# EAGLE design TCA0372_3x (EAGLE 9.3.0)
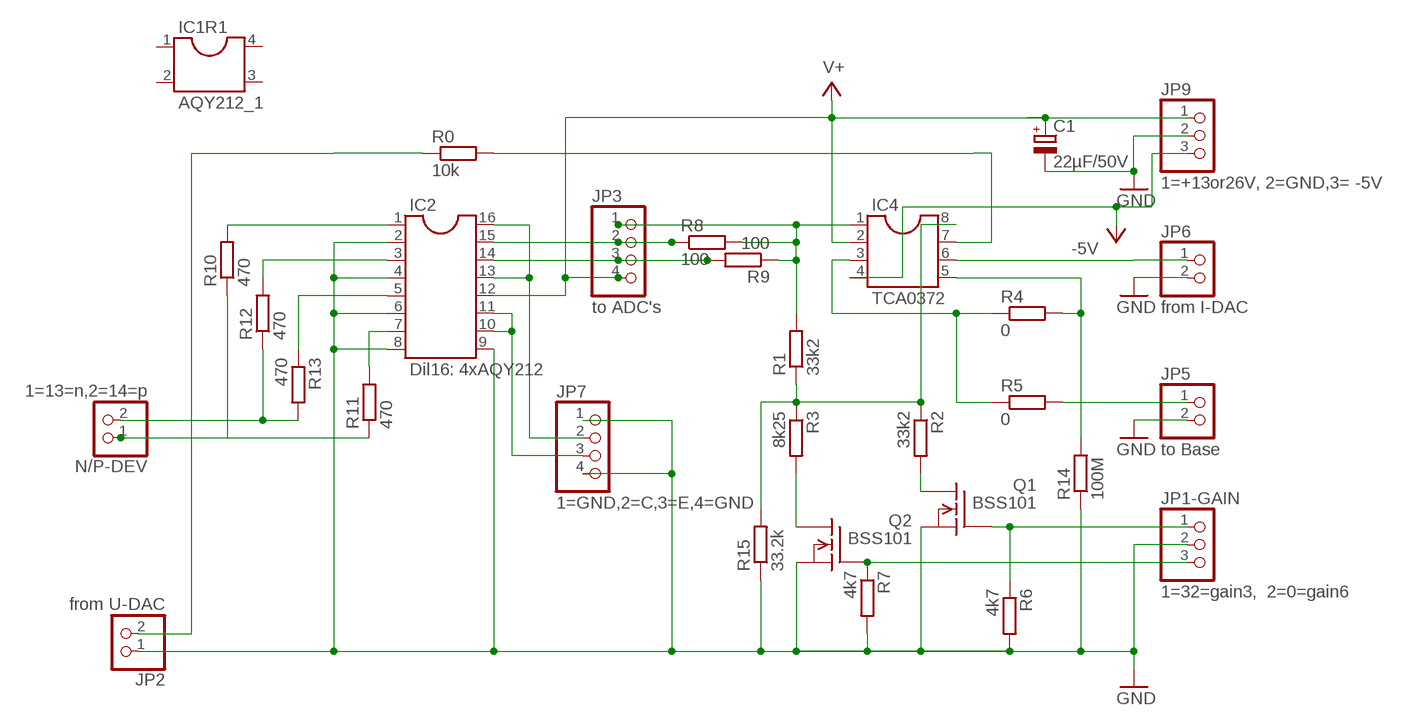
[diagram p0: schematic, sheet 1]

## Parts
C1  22µF/50V  CPOL-EUE5-10.5  [E5-10,5]
IC1R1  AQY212_1  DIL4S  [SOCKET-04]
IC2  Dil16: 4xAQY212  DIL16S  [SOCKET-16]
IC4  TCA0372  DIL8S  [SOCKET-08]
JP1-GAIN  1=32=gain3, 2=0=gain6  PINHD-1X3  [1X03]
JP2  from U-DAC  PINHD-1X2  [1X02]
JP3  to ADC's  PINHD-1X4  [1X04]
JP5  to Base  PINHD-1X2  [1X02]
JP6  from I-DAC  PINHD-1X2  [1X02]
JP7  1=GND,2=C,3=E,4=GND  PINHD-1X4  [1X04]
JP9  1=+13or26V, 2=GND,3= -5V  PINHD-1X3  [1X03]
N/P-DEV  1=13=n,2=14=p  PINHD-1X2  [1X02]
Q1  BSS101  [TO92]
Q2  BSS101  [TO92]
R0  10k  R-EU_0207/7  [0207/7]
R1  33k2  R-EU_0207/7  [0207/7]
R2  33k2  R-EU_0207/7  [0207/7]
R3  8k25  R-EU_0207/7  [0207/7]
R4  0  R-EU_0207/7  [0207/7]
R5  0  R-EU_0207/7  [0207/7]
R6  4k7  R-EU_0207/7  [0207/7]
R7  4k7  R-EU_0207/7  [0207/7]
R8  100  R-EU_0207/7  [0207/7]
R9  100  R-EU_0207/7  [0207/7]
R10  470  R-EU_0207/7  [0207/7]
R11  470  R-EU_0207/7  [0207/7]
R12  470  R-EU_0207/7  [0207/7]
R13  470  R-EU_0207/7  [0207/7]
R14  100M  R-EU_0207/7  [0207/7]
R15  33.2k  R-EU_0207/7  [0207/7]

## Nets
-5V: IC4.4 JP9.3
GND: C1.- IC2.2 IC2.4 IC2.6 IC2.8 IC2.9 JP1-GAIN.2 JP2.1 JP5.2 JP6.2 JP7.1 JP7.4 JP9.2 Q1.1(S) Q2.1(S) R6.2 R7.2 R14.1 R15.1
N$1: IC4.5 R4.2 R14.2
N$2: IC2.15 JP3.2 R8.1
N$3: IC4.7 R0.2
N$4: IC2.7 R11.2
N$5: Q1.3(D) R2.2
N$6: Q2.3(D) R3.2
N$7: JP1-GAIN.1 Q1.2(G) R6.1
N$8: JP1-GAIN.3 Q2.2(G) R7.1
N$9: IC4.6 JP6.1
N$10: IC2.3 R12.2
N$11: IC2.13 IC2.16 JP7.2
N$12: JP2.2 R0.1
N$13: IC4.3 R4.1 R5.1
N$15: IC2.5 R13.1
N$16: N/P-DEV.2 R12.1 R13.2
N$17: IC2.1 R10.2
N$19: N/P-DEV.1 R10.1 R11.1
N$20: JP5.1 R5.2
N$21: IC4.1 JP3.1 R1.2 R8.2 R9.1
N$22: IC4.8 R1.1 R2.1 R3.1 R15.2
N$23: IC2.10 IC2.11 JP7.3
N$25: IC2.14 JP3.3 R9.2
V+: C1.+ IC2.12 IC4.2 JP3.4 JP9.1
Unconnected: IC1R1.1 IC1R1.2 IC1R1.3 IC1R1.4

## Library data of the parts
C1 = rcl:CPOL-EU: POLARIZED CAPACITOR, European symbol; SPICEPREFIX: C
IC1R1 = ic-package:DIL4: Dual In Line / Socket
IC2 = ic-package:DIL16: Dual In Line / Socket
IC4 = ic-package:DIL8: Dual In Line / Socket
JP1-GAIN JP9 = pinhead:PINHD-1X3: PIN HEADER
JP2 JP5 JP6 N/P-DEV = pinhead:PINHD-1X2: PIN HEADER
JP3 JP7 = pinhead:PINHD-1X4: PIN HEADER
Q1 Q2 = transistor-fet:BSS101: N-Channel Enhancement MOSFET 200V; 0,16A; 11Ohm
R0 R1-R15 = rcl:R-EU_: RESISTOR, European symbol; SPICEPREFIX: R

## Board
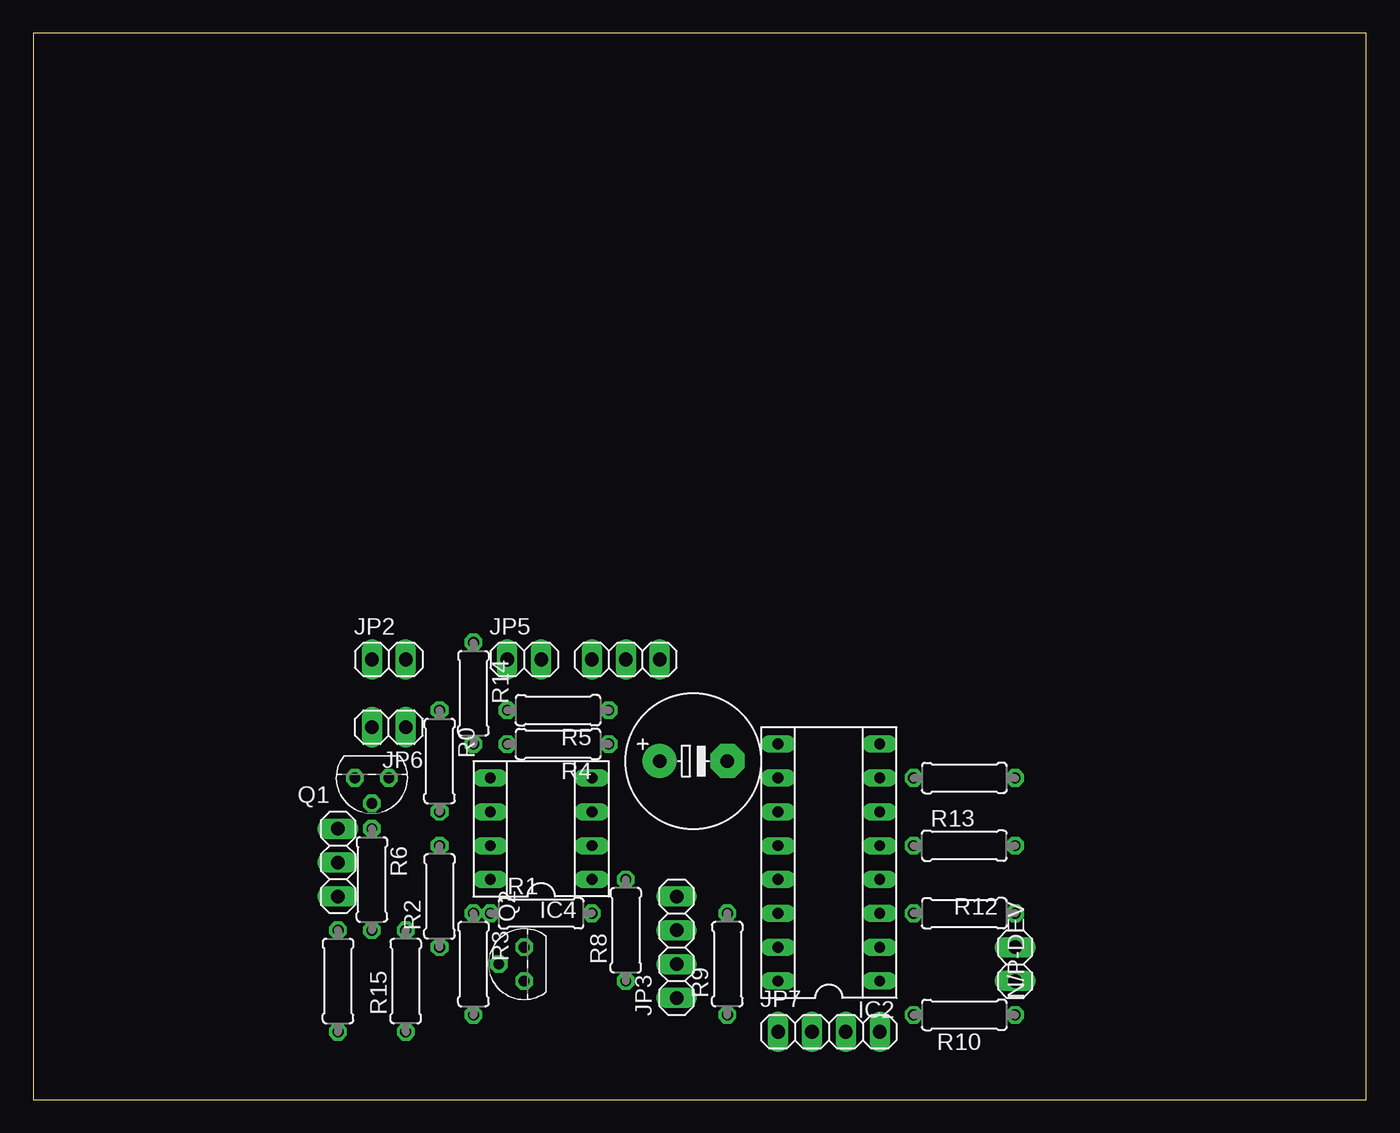
[diagram p1: board, top side]
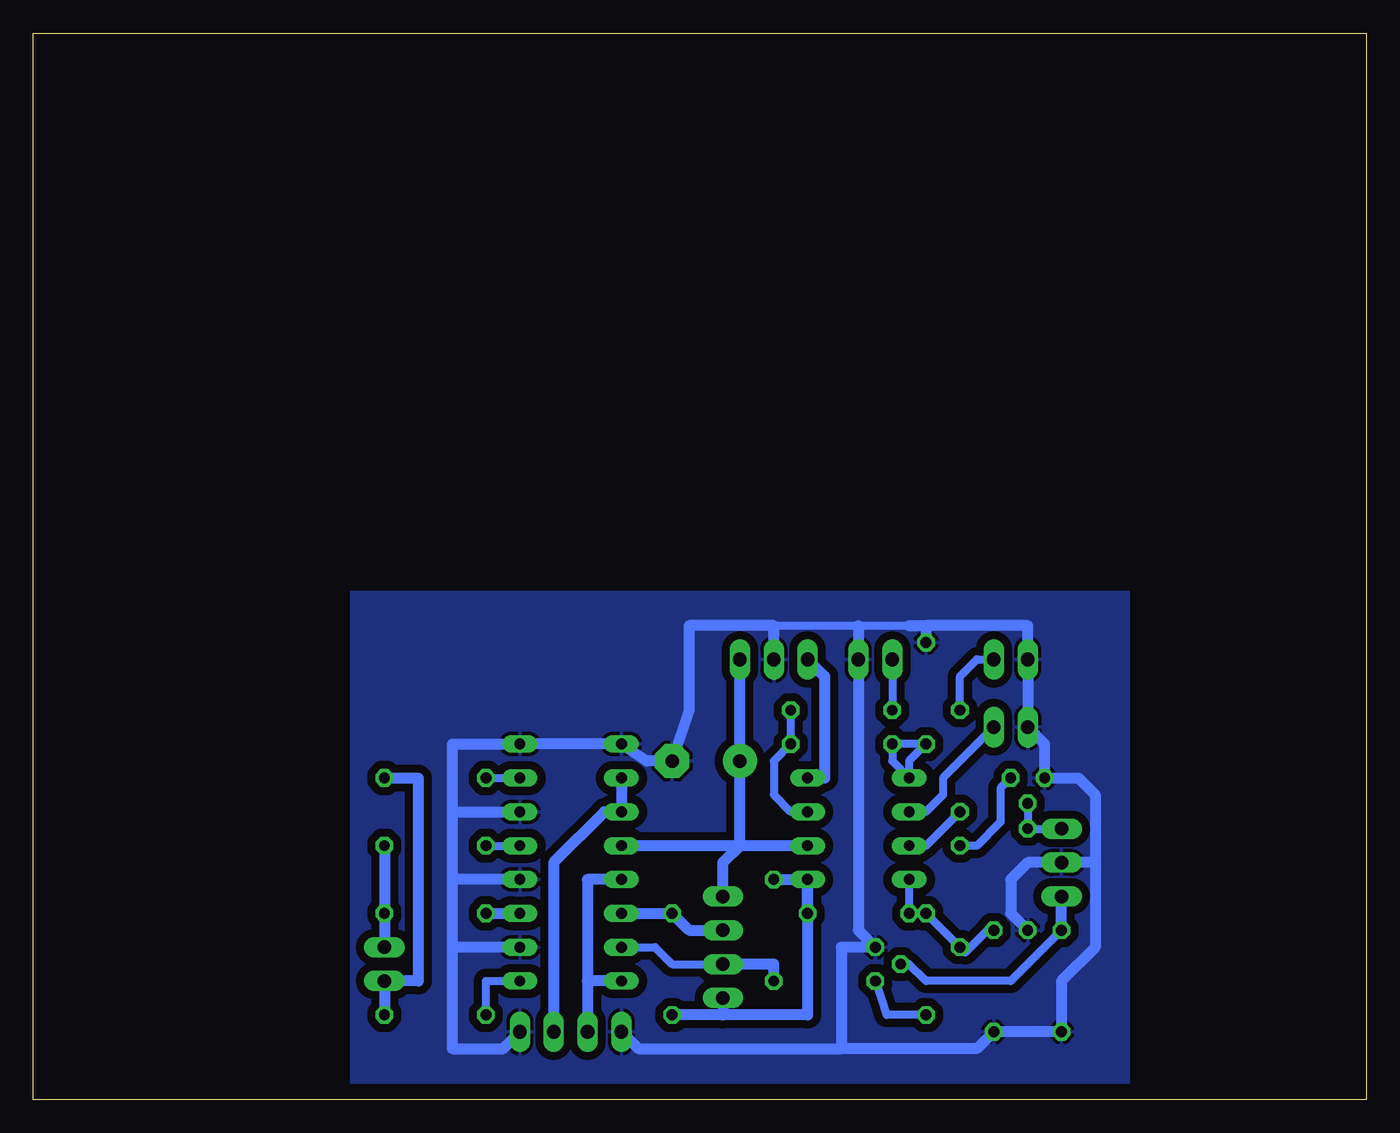
[diagram p2: board, bottom side, seen from below]

Size 100 x 80 mm. Coordinates in mm from the lower left corner, seen from the top.
Outline: 0,0 100,0 100,80 0,80 0,0
Copper layers (1*16): Top 0.035mm / dielectric 1.5mm / Bottom 0.035mm
Design rules "default": minimum track width 6mil, minimum drill 0.35mm, track to track 6mil, track to pad 6mil, pad to pad 6mil, via to via 6mil, smd to smd 6mil, copper to edge 40mil, drill to drill 6mil, minimum pad ring 10mil, minimum via ring 8mil, stop-mask expansion 4mil, vias tented up to drill 0mil, thermal gap 10mil

### Footprints (pad centres in the part's own frame; a part is rotated, then mirrored left to right if it is on the bottom)
E5-10,5 = drill 1.016 pad 2.54: + -2.54,0 | drill 1.016 pad 2.54 octagon: - 2.54,0
SOCKET-04 = drill 0.813 long: 1 -1.27,-3.81; 2 1.27,-3.81; 3 1.27,3.81; 4 -1.27,3.81
SOCKET-16 = drill 0.813 long: 1 -8.89,-3.81; 2 -6.35,-3.81; 3 -3.81,-3.81; 4 -1.27,-3.81; 5 1.27,-3.81; 6 3.81,-3.81; 7 6.35,-3.81; 8 8.89,-3.81; 9 8.89,3.81; 10 6.35,3.81; 11 3.81,3.81; 12 1.27,3.81; 13 -1.27,3.81; 14 -3.81,3.81; 15 -6.35,3.81; 16 -8.89,3.81
SOCKET-08 = drill 0.813 long: 1 -3.81,-3.81; 2 -1.27,-3.81; 3 1.27,-3.81; 4 3.81,-3.81; 5 3.81,3.81; 6 1.27,3.81; 7 -1.27,3.81; 8 -3.81,3.81
1X03 = drill 1.016 long: 1 -2.54,0; 2 0,0; 3 2.54,0
1X02 = drill 1.016 long: 1 -1.27,0; 2 1.27,0
1X04 = drill 1.016 long: 1 -3.81,0; 2 -1.27,0; 3 1.27,0; 4 3.81,0
TO92 = drill 0.813 octagon: 1 1.27,0; 2 0,1.905; 3 -1.27,0
0207/7 = drill 0.813 octagon: 1 -3.81,0; 2 3.81,0

### Placement (x,y rotation side)
C1  49.53,25.4 0 top
IC1R1  -5.08,-11.43 0 top  (outside the outline)
IC2  59.69,17.78 90 top
IC4  38.1,20.32 90 top
JP1-GAIN  22.86,17.78 270 top
JP2  26.67,33.02 0 top
JP3  48.26,11.43 90 top
JP5  36.83,33.02 0 top
JP6  26.67,27.94 180 top
JP7  59.69,5.08 0 top
JP9  44.45,33.02 180 top
N/P-DEV  73.66,10.16 90 top
Q1  25.4,24.13 180 top
Q2  36.83,10.16 90 top
R0  30.48,25.4 270 top
R1  38.1,13.97 0 top
R2  30.48,15.24 90 top
R3  33.02,10.16 270 top
R4  39.37,26.67 180 top
R5  39.37,29.21 180 top
R6  25.4,16.51 270 top
R7  22.86,8.89 270 top
R8  44.45,12.7 90 top
R9  52.07,10.16 90 top
R10  69.85,6.35 180 top
R11  69.85,24.13 180 top
R12  69.85,13.97 180 top
R13  69.85,19.05 0 top
R14  33.02,30.48 270 top
R15  27.94,8.89 90 top

### Tracks (layer width: path | path; a pad name or v marks a point on that pad's centre or on a via)
-5V
  Bottom 0.813: JP9.3 40.64,31.75 40.64,24.13 IC4.4
GND
  Bottom 0.61: 34.29,35.56 38.1,35.56 44.45,35.56
  Bottom 0.813: JP9.2 44.45,35.56 50.8,35.56 50.8,29.21 C1.- 53.98,25.4 IC2.9 IC2.8 68.58,26.67 68.58,21.59 | 38.1,35.56 JP5.2 38.1,12.7 Q2.1 39.37,11.43 39.37,3.81 | JP7.1 54.61,3.81 39.37,3.81 | 68.58,21.59 68.58,16.51 | 68.58,16.51 68.58,11.43 | 68.58,11.43 68.58,3.81 64.77,3.81 JP7.4 | IC2.4 68.58,16.51 | 68.58,21.59 IC2.6 | IC2.2 68.58,11.43 | 20.32,17.78 20.32,22.86 21.59,24.13 Q1.1 24.13,26.67 JP6.2 JP2.1 25.4,35.56 33.02,35.56 | 20.32,17.78 JP1-GAIN.2 25.4,17.78 26.67,16.51 26.67,13.97 R6.2 | 20.32,17.78 20.32,11.43 22.86,8.89 R7.2 R15.1 29.21,3.81 39.37,3.81 | 34.29,35.56 33.02,35.56 | 33.02,35.56 R14.1
  pour Bottom (isolate 0.61): 17.78,38.1 76.2,38.1 76.2,1.27 17.78,1.27
N$1
  Bottom 0.61: 35.56,25.4 IC4.5 34.29,25.4 R14.2 R4.2 35.56,25.4
N$2
  Bottom 0.61: IC2.15 53.34,11.43 52.07,10.16 JP3.2
  Bottom 0.813: R8.1 44.45,10.16 JP3.2
N$3
  Bottom 0.61: IC4.7 33.02,19.05 R0.2
N$4
  Bottom 0.61: R11.2 IC2.7
N$5
  Bottom 0.61: Q1.3 27.43,23.37 27.43,20.83 29.21,19.05 R2.2
N$6
  Bottom 0.61: Q2.3 35.98,6.35 R3.2
N$7
  Bottom 0.61: Q1.2 R6.1 JP1-GAIN.1
N$8
  Bottom 0.61: Q2.2 34.29,10.16 33.02,8.89 26.67,8.89 R7.1
  Bottom 0.813: R7.1 JP1-GAIN.3
N$9
  Bottom 0.61: IC4.6 33.02,21.59 31.75,22.86 31.75,24.13 JP6.1
N$10
  Bottom 0.813: R12.2 IC2.3
N$11
  Bottom 0.813: IC2.13 58.42,16.51 58.42,8.89 | 58.42,8.89 JP7.2 | IC2.16 58.42,8.89
N$12
  Bottom 0.61: R0.1 30.48,31.75 29.21,33.02 JP2.2
N$13
  Bottom 0.61: R5.1 R4.1 44.45,25.4 44.45,22.86 43.18,21.59 IC4.3
N$15
  Bottom 0.61: R13.1 IC2.5
N$16
  Bottom 0.813: R13.2 R12.1 N/P-DEV.2
N$17
  Bottom 0.61: R10.2 66.04,8.89 IC2.1
N$19
  Bottom 0.813: R11.1 71.12,24.13 71.12,8.89 N/P-DEV.1 R10.1
N$20
  Bottom 0.61: JP5.1 R5.2
N$21
  Bottom 0.813: R8.2 IC4.1 | 48.26,6.35 41.91,6.35 IC4.1 | 48.26,6.35 R9.1 | JP3.1 48.26,6.35 | R1.2 IC4.1
N$22
  Bottom 0.61: IC4.8 R1.1 R3.1 R2.1 30.08,11.03 28.42,12.7 R15.2
N$23
  Bottom 0.813: IC2.10 IC2.11 57.15,21.59 60.96,17.78 JP7.3
N$25
  Bottom 0.813: JP3.3 50.8,12.7 R9.2 IC2.14
V+
  Bottom 0.813: IC4.2 46.99,19.05 | 46.99,19.05 IC2.12 | JP3.4 48.26,17.78 46.99,19.05 | 46.99,19.05 C1.+ JP9.1